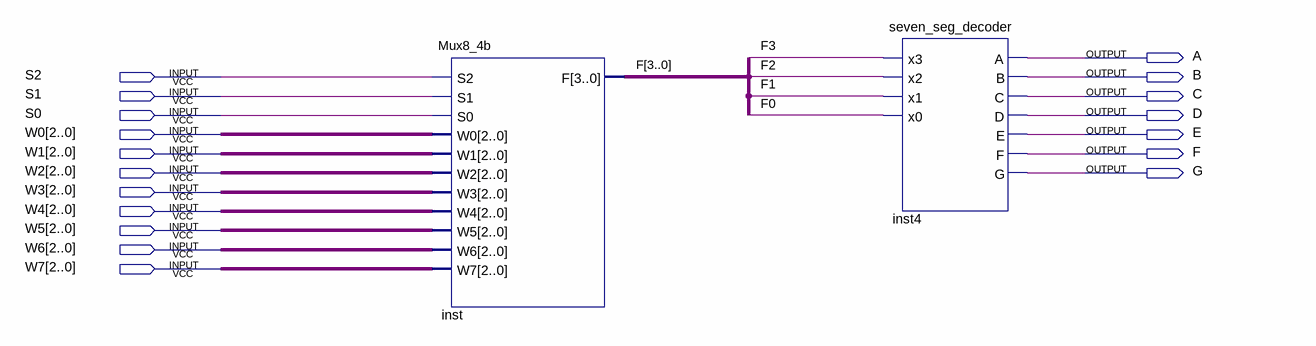
[diagram p0: schematic sheet]
// Quartus schematic MUX81.bdf as structural Verilog: 2 symbols, 18 pins
module MUX81 (
  input  S2,
  input  S1,
  input  S0,
  input  [2:0] W0,
  input  [2:0] W1,
  input  [2:0] W2,
  input  [2:0] W3,
  input  [2:0] W4,
  input  [2:0] W5,
  input  [2:0] W6,
  input  [2:0] W7,
  output A,
  output B,
  output C,
  output D,
  output E,
  output F,
  output G
);

  wire [3:0] F_bus;

  Mux8_4b inst (
    .S2(S2), .S1(S1), .S0(S0), .W0(W0), .W1(W1), .W2(W2), .W3(W3), .W4(W4), .W5(W5), .W6(W6), .W7(W7),
    .F(F_bus));
  seven_seg_decoder inst4 (
    .x3(F_bus[3]), .x2(F_bus[2]), .x1(F_bus[1]), .x0(F_bus[0]), .A(A), .B(B), .C(C), .D(D), .E(E), .F(F),
    .G(G));
endmodule
